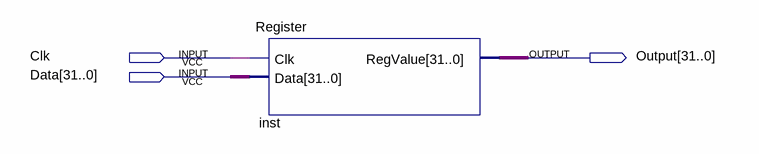
[diagram p0: schematic sheet]
// Quartus schematic TesteRegister.bdf as structural Verilog: 1 symbols, 3 pins
module TesteRegister (
  input  Clk,
  input  [31:0] Data,
  output [31:0] Output
);

  Register inst (.Clk(Clk), .Data(Data), .RegValue(Output));
endmodule
